# Altium schematic sheet rf_modulator_source_top.SchDoc: SPE Router
size 420 x 297 mm; Author: P. Daniel; CompanyName: WUT ISE; DrawnBy: P. Daniel; Organization: WUT ISE; Address1: WUT ISE; Address2: Nowowiejska 15/19 00-665 Warsaw; Address3: piotrmaciejdaniel@gmail.com; Revision: 1; SheetNumber: 1; SheetTotal: 2; ModifiedBy: -; CreateDate: 02-03.2023; CheckedDate: -; Title2: top schematic; DivGrp: WUT ISE; Designer: Piotr Daniel
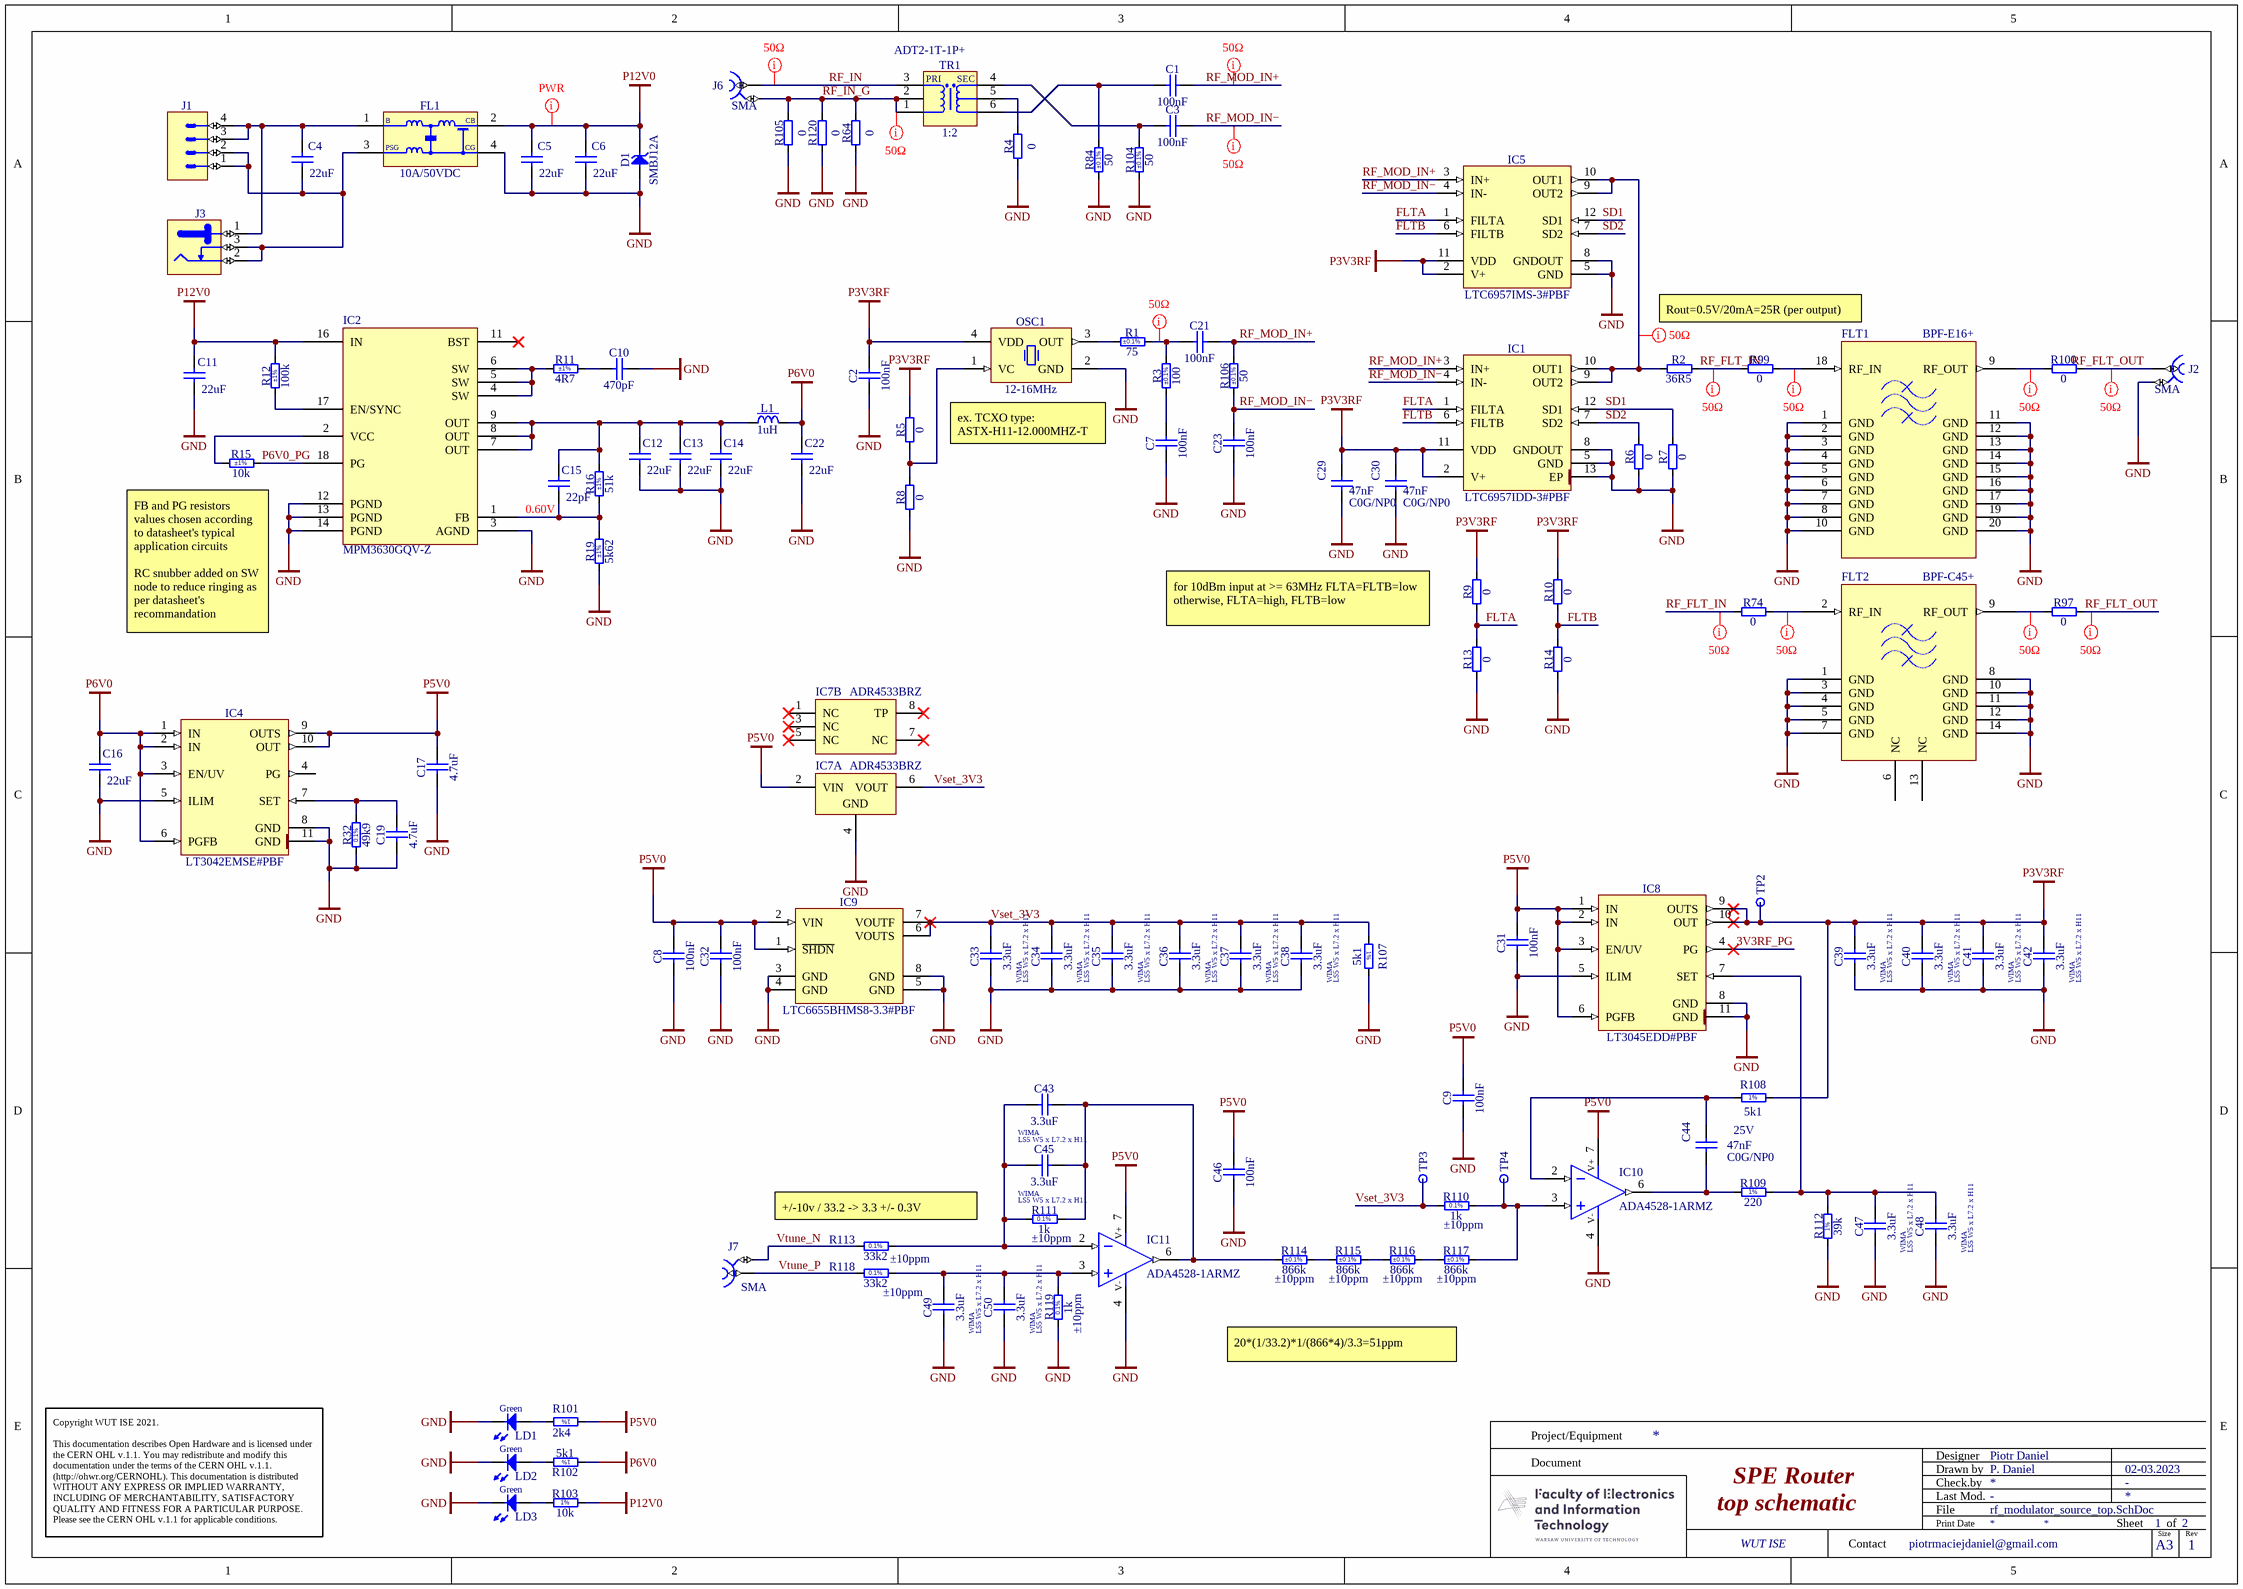
[diagram p0: rf_modulator_source_top.SchDoc]

## Parts
C1  100nF  [CAPC1608X87N]
C2  100nF  [CAPC1608X87N]
C3  100nF  [CAPC1608X87N]
C4  22uF  [CAPC3225X140N]
C5  22uF  [CAPC3225X140N]
C6  22uF  [CAPC3225X140N]
C7  100nF  [CAPC1608X87N]
C8  100nF  [CAPC1608X87N]
C9  100nF  [CAPC1608X87N]
C10  470pF  [CAPC1005X55N]
C11  22uF  [CAPC3225X140N]
C12  22uF  [CAPC3225X140N]
C13  22uF  [CAPC3225X140N]
C14  22uF  [CAPC3225X140N]
C15  22pF  [CAPC1005X55N]
C16  22uF  [CAPC3225X140N]
C17  4.7uF  [CAPC3216X180N]
C19  4.7uF  [CAPC3216X180N]
C21  100nF  [CAPC1608X87N]
C22  22uF  [CAPC3225X140N]
C23  100nF  [CAPC1608X87N]
C29  47nF  TC: C0G/NP0  [CAPC2012X135N]
C30  47nF  TC: C0G/NP0  [CAPC2012X135N]
C31  100nF  [CAPC1608X87N]
C32  100nF  [CAPC1608X87N]
C33  3.3uF  Manufacturer: WIMA  Case: LS5 W5 x L7.2 x H11  [CAPR500-500X720X1000]
C34  3.3uF  Manufacturer: WIMA  Case: LS5 W5 x L7.2 x H11  [CAPR500-500X720X1000]
C35  3.3uF  Manufacturer: WIMA  Case: LS5 W5 x L7.2 x H11  [CAPR500-500X720X1000]
C36  3.3uF  Manufacturer: WIMA  Case: LS5 W5 x L7.2 x H11  [CAPR500-500X720X1000]
C37  3.3uF  Manufacturer: WIMA  Case: LS5 W5 x L7.2 x H11  [CAPR500-500X720X1000]
C38  3.3uF  Manufacturer: WIMA  Case: LS5 W5 x L7.2 x H11  [CAPR500-500X720X1000]
C39  3.3uF  Manufacturer: WIMA  Case: LS5 W5 x L7.2 x H11  [CAPR500-500X720X1000]
C40  3.3uF  Manufacturer: WIMA  Case: LS5 W5 x L7.2 x H11  [CAPR500-500X720X1000]
C41  3.3uF  Manufacturer: WIMA  Case: LS5 W5 x L7.2 x H11  [CAPR500-500X720X1000]
C42  3.3uF  Manufacturer: WIMA  Case: LS5 W5 x L7.2 x H11  [CAPR500-500X720X1000]
C43  3.3uF  Manufacturer: WIMA  Case: LS5 W5 x L7.2 x H11  [CAPR500-500X720X1000]
C44  47nF  Voltage: 25V  TC: C0G/NP0  [CAPC2012X135N]
C45  3.3uF  Manufacturer: WIMA  Case: LS5 W5 x L7.2 x H11  [CAPR500-500X720X1000]
C46  100nF  [CAPC1608X87N]
C47  3.3uF  Manufacturer: WIMA  Case: LS5 W5 x L7.2 x H11  [CAPR500-500X720X1000]
C48  3.3uF  Manufacturer: WIMA  Case: LS5 W5 x L7.2 x H11  [CAPR500-500X720X1000]
C49  3.3uF  Manufacturer: WIMA  Case: LS5 W5 x L7.2 x H11  [CAPR500-500X720X1000]
C50  3.3uF  Manufacturer: WIMA  Case: LS5 W5 x L7.2 x H11  [CAPR500-500X720X1000]
D1  SMBJ12A  [DIOM5336X265N]
FL1  10A/50VDC  [FIL_MURATA_BNX02]
FLT1  BPF-E16+  [HR1176]
FLT2  BPF-C45+  [HU1186]
IC1  LTC6957IDD-3#PBF  [SON45P300X300X80-13N-R175X248]
IC2  MPM3630GQV-Z  [MPM3610A]
IC4  LT3042EMSE#PBF  [SOP50P490X110-11N-R168X198]
IC5  LTC6957IMS-3#PBF  [SOP65P490X110-12N]
IC7  ADR4533BRZ  [ADI-R-8_L]  (parts A,B of 2)
IC8  LT3045EDD#PBF  [SON50P300X300X80-11N-R175X248]
IC9  LTC6655BHMS8-3.3#PBF  [SOP65P490X110-8N]
IC10  ADA4528-1ARMZ  [SOP65P490X110-8N]
IC11  ADA4528-1ARMZ  [SOP65P490X110-8N]
J1  Mini-Fit Jr.™  [MOLEX_39-30-0040]  (value not drawn)
J2  SMA  [MOLEX_73251-2121]
J3  Jack  [SWITCHCRAFT_712RA]  (value not drawn)
J6  SMA  [MOLEX_73251-2121]
J7  SMA  [MOLEX_73251-2121]
L1  1uH  [INDM3225X210N]
LD1  Green  [LED_KINGBRIGHT_KPH-1608CGCK]
LD2  Green  [LED_KINGBRIGHT_KPH-1608CGCK]
LD3  Green  [LED_KINGBRIGHT_KPH-1608CGCK]
OSC1  12-16MHz  [OSC_TAITIEN_3.2X2.5X1.0]
R1  75  Tolerance: ±0.1%  [RESC1608X55N]
R2  36R5  [RESC1005X40N]
R3  100  Tolerance: ±0.1%  [RESC1608X64N]
R4  0  [RESC1608X55N]
R5  0  [RESC1608X55N]
R6  0  [RESC1608X55N]
R7  0  [RESC1608X55N]
R8  0  [RESC1608X55N]
R9  0  [RESC1608X55N]
R10  0  [RESC1608X55N]
R11  4R7  Tolerance: ±1%  [RESC1005X40N]
R12  100k  Tolerance: ±1%  [RESC1005X40N]
R13  0  [RESC1608X55N]
R14  0  [RESC1608X55N]
R15  10k  Tolerance: ±1%  [RESC1005X40N]
R16  51k  Tolerance: ±1%  [RESC1005X40N]
R19  5k62  Tolerance: ±1%  [RESC1005X40N]
R32  49k9  [RESC1608X55N]
R64  0  [RESC1608X55N]
R74  0  [RESC1005X40N]
R84  50  Tolerance: ±0.1%  [RES_VISHAY_FC0603]
R97  0  [RESC1005X40N]
R99  0  [RESC1005X40N]
R100  0  [RESC1005X40N]
R101  2k4  [RESC1005X40N]
R102  5k1  [RESC1005X40N]
R103  10k  [RESC1005X40N]
R104  50  Tolerance: ±0.1%  [RES_VISHAY_FC0603]
R105  0  [RESC1608X55N]
R106  50  Tolerance: ±0.1%  [RES_VISHAY_FC0603]
R107  5k1  [RESC1005X40N]
R108  5k1  [RESC1005X40N]
R109  220  [RESC1005X40N]
R110  1k  TC: ±10ppm  [RESC1608X55N]
R111  1k  TC: ±10ppm  [RESC1608X55N]
R112  39k  [RESC1608X55N]
R113  33k2  TC: ±10ppm  [RESC1608X55N]
R114  866k  Tolerance: ±0.1%  TC: ±10ppm  [RESC2012X60N]
R115  866k  Tolerance: ±0.1%  TC: ±10ppm  [RESC2012X60N]
R116  866k  Tolerance: ±0.1%  TC: ±10ppm  [RESC2012X60N]
R117  866k  Tolerance: ±0.1%  TC: ±10ppm  [RESC2012X60N]
R118  33k2  TC: ±10ppm  [RESC1608X55N]
R119  1k  TC: ±10ppm  [RESC1608X55N]
R120  0  [RESC1608X55N]
TP2  Test Point  [TPS127]  (value not drawn)
TP3  Test Point  [TPS127]  (value not drawn)
TP4  Test Point  [TPS127]  (value not drawn)
TR1  1:2  Manufacturer Part Number: ADT2-1T-1P+  [XFMR_MINI-CIRCUITS_CD542]

## Nets
GND: C2.1 C5.1 C6.1 C7.1 C8.1 C9.1 C10.2 C11.1 C12.1 C13.1 C14.1 C16.1 C17.1 C19.1 C22.1 C23.1 C29.1 C30.1 C31.1 C32.1 C33.1 C34.1 C35.1 C36.1 C37.1 C38.1 C39.1 C40.1 C41.1 C42.1 C46.1 C47.1 C48.1 C49.1 C50.1 D1.2(A) FL1.4(CG) FLT1.1(GND) FLT1.2(GND) FLT1.3(GND) FLT1.4(GND) FLT1.5(GND) FLT1.6(GND) FLT1.7(GND) FLT1.8(GND) FLT1.10(GND) FLT1.11(GND) FLT1.12(GND) FLT1.13(GND) FLT1.14(GND) FLT1.15(GND) FLT1.16(GND) FLT1.17(GND) FLT1.19(GND) FLT1.20(GND) FLT2.1(GND) FLT2.3(GND) FLT2.4(GND) FLT2.5(GND) FLT2.7(GND) FLT2.8(GND) FLT2.10(GND) FLT2.11(GND) FLT2.12(GND) FLT2.14(GND) IC1.5(GND) IC1.8(GNDOUT) IC1.13(EP) IC2.3(AGND) IC2.12(PGND) IC2.13(PGND) IC2.14(PGND) IC4.5(ILIM) IC4.8(GND) IC4.11(GND) IC5.5(GND) IC5.8(GNDOUT) IC7.4(GND) IC8.5(ILIM) IC8.8(GND) IC8.11(GND) IC9.3(GND) IC9.4(GND) IC9.5(GND) IC9.8(GND) IC10.4(V-) IC11.4(V-) J2.2 LD1.1(C) LD2.1(C) LD3.1(C) OSC1.2(GND) R4.1 R6.1 R7.1 R8.1 R13.1 R14.1 R19.1 R32.1 R64.1 R84.1 R104.1 R105.1 R107.2 R112.1 R119.1 R120.1
P3V3RF: C2.2 C29.2 C30.2 C39.2 C40.2 C41.2 C42.2 IC1.2(V+) IC1.11(VDD) IC5.2(V+) IC5.11(VDD) IC8.9(OUTS) IC8.10(OUT) OSC1.4(VDD) R5.2 R9.2 R10.2 R108.1 TP2.1
P5V0: C8.2 C9.2 C17.2 C31.2 C32.2 C46.2 IC4.9(OUTS) IC4.10(OUT) IC7.2(VIN) IC8.1(IN) IC8.2(IN) IC8.3(EN/UV) IC8.6(PGFB) IC9.1(~{SHDN}) IC9.2(VIN) IC10.7(V+) IC11.7(V+) R101.1
P6V0: C16.2 C22.2 IC4.1(IN) IC4.2(IN) IC4.3(EN/UV) IC4.6(PGFB) L1.2 R102.1
P12V0: C5.2 C6.2 C11.2 D1.1(C) FL1.2(CB) IC2.16(IN) R12.2 R103.2
3V3RF_PG: IC8.4(PG)
FLTA: IC1.1(FILTA) IC5.1(FILTA) R9.1 R13.2
FLTB: IC1.6(FILTB) IC5.6(FILTB) R10.1 R14.2
P6V0_PG: IC2.18(PG) R15.2
RF_FLT_IN: R2.2 R74.1 R99.1
RF_FLT_OUT: J2.1 R97.2 R100.2
RF_IN: J6.1 TR1.3(PDOT)
RF_IN_G: J6.2 R64.2 R105.2 R120.2 TR1.1(P) TR1.2(NC)
RF_MOD_IN+: C1.2 C21.2 IC1.3(IN+) IC5.3(IN+) R106.2
RF_MOD_IN−: C3.2 C23.2 IC1.4(IN-) IC5.4(IN-) R106.1
SD1: IC1.12(SD1) IC5.12(SD1) R7.2
SD2: IC1.7(SD2) IC5.7(SD2) R6.2
Vset_3V3: C33.2 C34.2 C35.2 C36.2 C37.2 C38.2 IC7.6(VOUT) IC9.6(VOUTS) IC9.7(VOUTF) R107.1 R110.1 TP3.1
Vtune_N: J7.2 R113.1
Vtune_P: J7.1 R118.1
NetC1_1: C1.1 R84.2 TR1.6(SDOT)
NetC3_1: C3.1 R104.2 TR1.4(S)
NetC4_1: C4.1 FL1.3(PSG) J1.1 J1.2 J3.2 J3.3
NetC4_2: C4.2 FL1.1(B) J1.3 J1.4 J3.1
NetC7_2: C7.2 R3.1
NetC10_1: C10.1 R11.2
NetC12_2: C12.2 C13.2 C14.2 C15.2 IC2.7(OUT) IC2.8(OUT) IC2.9(OUT) L1.1 R16.2
NetC15_1: C15.1 IC2.1(FB) R16.1 R19.2
NetC19_2: C19.2 IC4.7(SET) R32.2
NetC21_1: C21.1 R1.2 R3.2
NetC43_1: C43.1 C45.1 IC11.2(IN-) R111.1 R113.2
NetC43_2: C43.2 C45.2 IC11.6(OUT) R111.2 R114.1
NetC44_1: C44.1 IC10.6(OUT) R109.1
NetC44_2: C44.2 IC10.2(IN-) R108.2
NetC47_2: C47.2 C48.2 IC8.7(SET) R109.2 R112.2
NetC49_2: C49.2 C50.2 IC11.3(IN+) R118.2 R119.2
NetFLT1_9: FLT1.9(RF_OUT) R100.1
NetFLT1_18: FLT1.18(RF_IN) R99.2
NetFLT2_2: FLT2.2(RF_IN) R74.2
NetFLT2_9: FLT2.9(RF_OUT) R97.1
NetIC1_9: IC1.9(OUT2) IC1.10(OUT1) IC5.9(OUT2) IC5.10(OUT1) R2.1
NetIC2_2: IC2.2(VCC) R15.1
NetIC2_4: IC2.4(SW) IC2.5(SW) IC2.6(SW) R11.1
NetIC2_17: IC2.17(EN/SYNC) R12.1
NetIC10_3: IC10.3(IN+) R110.2 R117.2 TP4.1
NetLD1_2: LD1.2(A) R101.2
NetLD2_2: LD2.2(A) R102.2
NetLD3_2: LD3.2(A) R103.1
NetOSC1_1: OSC1.1(VC) R5.1 R8.2
NetOSC1_3: OSC1.3(OUT) R1.1
NetR4_2: R4.2 TR1.5(SCT)
NetR114_2: R114.2 R115.1
NetR115_2: R115.2 R116.1
NetR116_2: R116.2 R117.1

Not connected (* = marked no-connect by the designer): FLT2 6(NC) 13(NC); IC2 11(BST)*; IC4 4(PG); IC7 1(NC)* 3(NC)* 5(NC)* 7(NC)* 8(TP)*

## Layout directives
net class 50Ohm: NetC21_1, NetFLT1_9, NetFLT1_18, NetFLT2_2, NetFLT2_9, NetIC1_9, RF_FLT_IN, RF_FLT_OUT, RF_IN, RF_IN_G, RF_MOD_IN+, RF_MOD_IN−
net class PWR: P12V0

## Notes on the sheet
- Rout=0.5V/20mA=25R (per output)
- ex. TCXO type:
  ASTX-H11-12.000MHZ-T
- (near C15) 0.60V
- (near R15) FB and PG resistors values chosen according to datasheet's typical application circuits
  RC snubber added on SW node to reduce ringing as per datasheet's recommandation
- for 10dBm input at >= 63MHz FLTA=FLTB=low
  otherwise, FLTA=high, FLTB=low
- (near R113) +/-10v / 33.2 -> 3.3 +/- 0.3V
- 20*(1/33.2)*1/(866*4)/3.3=51ppm
- Project/Equipment
- Document
- Designer
- Drawn by
- Check.by
- Copyright WUT ISE 2021.
  This documentation describes Open Hardware and is licensed under the CERN OHL v.1.1. You may redistribute and modify this documentation under the terms of the CERN OHL v.1.1. (http://ohwr.org/CERNOHL). This documentation is distributed WITHOUT ANY EXPRESS OR IMPLIED WARRANTY, INCLUDING OF MERCHANTABILITY, SATISFACTORY QUALITY AND FITNESS FOR A PARTICULAR PURPOSE. Please see the CERN OHL v.1.1 for applicable conditions.
- Contact
- File
- Last Mod.
- Print Date
- Sheet
- Size
- A3
- of
- Rev
- (in symbol R0402_2K4_1%_0.0625W_100PPM) 1%
- (in symbol R0402_5K1_1%_0.0625W_100PPM) 1%
- (in symbol R0402_10K_1%_0.0625W_100PPM) 1%
- (in symbol R0402_220R_1%_0.0625W_100PPM) 1%
- (in symbol R0603_1K_0.1%_0.063W_10PPM) 0.1%
- (in symbol R0603_33K2_0.1%_0.063W_10PPM) 0.1%
- (in symbol R0603_39K_1%_0.1W_100PPM) 1%
- (in symbol R0603_49K9_0.1%_0.063W_10PPM) 0.1%
- (in symbol XFMR_MINI-CIRCUITS_ADT2-1T-1P+) PRI; SEC

## Library data of the parts
C1-C3 C7-C9 C21 C23 C31 C32 C46 = CC0603_100NF_50V_10%_X7R: Non-polarised capacitor; Part Description: SMD Multilayer Chip Ceramic Capacitor; Manufacturer: GENERIC; Manufacturer1 Part Number: 223858615649; Voltage: 50V; TC: X7R; Tolerance: ±10%; Part Number: CC0603_100NF_50V_10%_X7R; Component Kind: Standard; Component Type: Standard; Pin Count: 2; Value: 100nF; Status: Preferred; Manufacturer Part Number: CC0603_100NF_50V_10%_X7R; Case: 0603; Mounted: Yes; Socket: No; SMD: Yes; Sense: No; Manufacturer1 Example: PHYCOMP; Manufacturer1 ComponentHeight: 0.87mm; HelpURL: \\cern.ch\dfs\Applications\Altium\Datasheets\CC0603_X7R_PHYCOMP.pdf; Author: CERN DEM JLC; CreateDate: 03/12/2007; LatestRevisionDate: 03/12/2007
C4-C6 C11-C14 C16 C22 = CC1210_22UF_25V_10%_X7R: Non-polarised capacitor; Part Description: SMD Multilayer Chip Ceramic Capacitor; Manufacturer: GENERIC; Manufacturer1 Part Number: C1210C226K3RAC; Voltage: 25V; TC: X7R; Tolerance: ±10%; Part Number: CC1210_22UF_25V_10%_X7R; Component Kind: Standard; Component Type: Standard; Pin Count: 2; Value: 22uF; Status: None; Manufacturer Part Number: CC1210_22UF_25V_10%_X7R; Case: 1210; Mounted: Yes; Socket: No; SMD: Yes; Sense: No; Manufacturer1 Example: KEMET; Manufacturer1 ComponentHeight: 1.4mm; HelpURL: \\cern.ch\dfs\Applications\Altium\Datasheets\CC1210_X7R_KEMET.pdf; Author: CERN DEM BC; CreateDate: 20.08.2020; LatestRevisionDate: 20.08.2020
C10 = CC0402_470PF_50V_10%_X7R: Non-polarised capacitor; Part Description: SMD Multilayer Chip Ceramic Capacitor; Manufacturer: GENERIC; Manufacturer1 Part Number: 223858715618; Voltage: 50V; TC: X7R; Tolerance: ±10%; Part Number: CC0402_470PF_50V_10%_X7R; Component Kind: Standard; Component Type: Standard; Pin Count: 2; Value: 470pF; Status: Not Recommended; Manufacturer Part Number: CC0402_470PF_50V_10%_X7R; Case: 0402; Mounted: Yes; Socket: No; SMD: Yes; Sense: No; Manufacturer1 Example: PHYCOMP; Manufacturer1 ComponentHeight: 0.55mm; HelpURL: \\cern.ch\dfs\Applications\Altium\Datasheets\CC0402_NP0_PHYCOMP.pdf; Author: CERN DEM JLC; CreateDate: 03.12.2007; LatestRevisionDate: 03.12.2007
C15 = CC0402_22PF_50V_5%_C0G: Non-polarised capacitor; Part Description: SMD Multilayer Chip Ceramic Capacitor; Manufacturer: GENERIC; Manufacturer1 Part Number: C0402C220J5GACTU; Voltage: 50V; TC: C0G/NP0; Tolerance: ±5%; Part Number: CC0402_22PF_50V_5%_C0G; Component Kind: Standard; Component Type: Standard; Pin Count: 2; Value: 22pF; Status: Preferred; Manufacturer Part Number: CC0402_22PF_50V_5%_C0G; Case: 0402; Mounted: Yes; Socket: No; SMD: Yes; Sense: No; Manufacturer1 Example: KEMET; Manufacturer1 ComponentHeight: 0.55mm; HelpURL: \\cern.ch\dfs\Applications\Altium\Datasheets\CC0402_C0G_KEMET_(Commercial Grade).pdf; Author: CERN DEM JLC; CreateDate: 03.12.2007; LatestRevisionDate: 03.12.2007
C17 C19 = CC1206_4.7UF_16V_10%_X5R: Non-polarised capacitor; Part Description: SMD Multilayer Chip Ceramic Capacitor; Manufacturer: GENERIC; Manufacturer1 Part Number: C1206C475K4PAC; Voltage: 16V; TC: X5R; Tolerance: ±10%; Part Number: CC1206_4.7UF_16V_10%_X5R; Component Kind: Standard; Component Type: Standard; Pin Count: 2; Value: 4.7uF; Status: Preferred; Manufacturer Part Number: CC1206_4.7UF_16V_10%_X5R; Case: 1206; Mounted: Yes; Socket: No; SMD: Yes; Sense: No; Manufacturer1 Example: KEMET; Manufacturer1 ComponentHeight: 1.8mm; HelpURL: \\cern.ch\dfs\Applications\Altium\Datasheets\CC1206_X5R_KEMET.pdf; Author: CERN DEM JLC; CreateDate: 03/12/2007; LatestRevisionDate: 03/12/2007
C29 C30 = CC0805_47NF_25V_5%_C0G: Non-polarised capacitor; Part Description: SMD Multilayer Chip Ceramic Capacitor; Manufacturer: GENERIC; Manufacturer1 Part Number: C0805C473J3GACTU; Voltage: 25V; Tolerance: ±5%; Part Number: CC0805_47NF_25V_5%_C0G; Component Kind: Standard; Component Type: Standard; Pin Count: 2; Value: 47nF; Status: None; Manufacturer Part Number: CC0805_47NF_25V_5%_C0G; Case: 0805; Mounted: Yes; Socket: No; SMD: Yes; Sense: No; Manufacturer1 Example: KEMET; Manufacturer1 ComponentHeight: 1.4mm; HelpURL: \\cern.ch\dfs\Applications\Altium\Datasheets\CC0805_C0G_KEMET_(Commercial Grade).pdf; Author: CERN DEM JLC; CreateDate: 18/01/2011; LatestRevisionDate: 18/01/2011
C33-C43 C45 C47-C50 = CPER_3.3UF_63V_5%_WIMA_MKS2: Non-polarised capacitor; Part Description: Metallized Polypropylene Film Capacitor (MKP2); Manufacturer Part Number: MKS2C043301K00JSSD; Voltage: 63V; Tolerance: ±5%; Part Number: CPER_3.3UF_63V_5%_WIMA_MKS2; Component Kind: Standard; Component Type: Standard; Pin Count: 2; Value: 3.3uF; Status: None; Mounted: Yes; Socket: No; SMD: No; Sense: No; ComponentHeight: 10mm; HelpURL: \\cern.ch\dfs\Applications\Altium\Datasheets\CPPR_WIMA_MKP2.pdf; Author: GK; CreateDate: 04.10.2018; LatestRevisionDate: 04.10.2018
C44 = CC0805_47NF_25V_5%_C0G: Non-polarised capacitor; Part Description: SMD Multilayer Chip Ceramic Capacitor; Manufacturer: GENERIC; Manufacturer1 Part Number: C0805C473J3GACTU; Tolerance: ±5%; Part Number: CC0805_47NF_25V_5%_C0G; Component Kind: Standard; Component Type: Standard; Pin Count: 2; Value: 47nF; Status: None; Manufacturer Part Number: CC0805_47NF_25V_5%_C0G; Case: 0805; Mounted: Yes; Socket: No; SMD: Yes; Sense: No; Manufacturer1 Example: KEMET; Manufacturer1 ComponentHeight: 1.4mm; HelpURL: \\cern.ch\dfs\Applications\Altium\Datasheets\CC0805_C0G_KEMET_(Commercial Grade).pdf; Author: CERN DEM JLC; CreateDate: 18/01/2011; LatestRevisionDate: 18/01/2011
D1 = SMBJ12A: Zener Diode; Part Description: Uni-Directional Transient Voltage Suppressor Diode; Manufacturer: FAIRCHILD SEMICONDUCTOR; Voltage: 12V; Power: 600W; PressFit: No; Bonding: No; Part Number: SMBJ12A; Component Kind: Standard; Component Type: Standard; Device: SMBJ12A; PackageDescription: DO-214-AA/SMB Diode, Molded Body; 5.34mm L X 3.625mm W X 2.65mm H, IPC Medium Density; Manufacturer Part Number: SMBJ12A; Pin Count: 2; Case: DO-214AA; Mounted: Yes; Socket: No; SMD: Yes; Sense: No; ComponentHeight: 2.65mm; HelpURL: \\cern.ch\dfs\Applications\Altium\Datasheets\SMBJ.pdf; Author: CERN DEM JLC; CreateDate: 10.04.2013; LatestRevisionDate: 10.04.2013
FL1 = FIL_MURATA_BNX022-01L: Block Type EMIFIL (LC Combined); Part Description: Block Type EMIFIL (LC Combined) SMD Type, BNX02* Series; Manufacturer: MURATA; Resistance: 0.5R; Part Number: FIL_MURATA_BNX022-01L; Component Kind: Standard; Component Type: Standard; Pin Count: 2; Value: 10A/50VDC; Status: None; Manufacturer Part Number: BNX022-01L; Mounted: Yes; Socket: No; SMD: Yes; Sense: No; ComponentHeight: 3.3mm; HelpURL: \\cern.ch\dfs\Applications\Altium\Datasheets\FIL_MURATA_BNX022-01L.pdf; Author: CERN DEM JLC; CreateDate: 10.10.2012; LatestRevisionDate: 10.10.2012
FLT1 = BPF-E16+: Band Pass Filter, 16MHz; Manufacturer: Mini-Circuits; Average Input Power: 500mW; Input Impedance: 50R; Insertion Loss-Max: 3dB; VSWR: 1.9; Supplier 1: Digikey; Manufacturer Part Number: BPF-E16+; RoHS: Yes; Stock 1: 41; Pricing 1: 1=36,35, 10=33,312, 50=31,8 (USD); Mounting Technology: Surface Mount; Terminal Finish: Gold; Min Operating Temperature: -40°C; Max Operating Temperature: 85°C; JESD-609 Code: e4; Center or Cutoff Frequency (fo/fc): 16MHz; Filter Type: BAND PASS FILTER; Output Impedance: 50R; Length: 30.48mm; Width: 30.48mm; Height: 9.4mm; RoHS Compliant: Yes; Reach SVHC Compliant: Yes; ComponentLink1URL: https://datasheet.ciiva.com:443/pdfs/VipMasterIC/IC/MINI/MINI-S-A0002947472/MINI-S-A0002947472-1.pdf?src-supplier=IHS+Markit; ComponentLink1Description: https://datasheet.ciiva.com:443/pdfs/VipMasterIC/IC/MINI/MINI-S-A0002947472/MINI-S-A0002947472-1.pdf?src-supplier=IHS+Markit; Supplier Part Number 1: 3157-BPF-E16+CT-ND
FLT2 = BPF-C45+: Band Pass Filter, 45MHz, 14 Pin(s); Manufacturer: Mini-Circuits; Supplier 1: Digikey; Manufacturer Part Number: BPF-C45+; RoHS: Yes; Stock 1: 219; Pricing 1: 1=48,49, 10=45,456, 25=42,4204, 50=40,908, 100=39,3841 (USD); Supplier Part Number 1: 3157-BPF-C45+CT-ND
IC1 = LTC6957IDD-3#PBF: Low Phase Noise, Dual Output Buffer/Driver/Logic Converter, CMOS Logic, In-Phase Outputs; Manufacturer: LINEAR TECHNOLOGY; PressFit: No; Bonding: No; Part Number: LTC6957IDD-3#PBF; Component Kind: Standard; Component Type: Standard; Device: LTC6957IDD-3#PBF; PackageDescription: SON, 0.45mm Pitch; 12 Pin, 3.00mm W X 3.00mm L X 0.80mm H Body (w/Thermal tab 1.75 x 2.48mm), IPC Medium Density; Part Description: Low Phase Noise, Dual Output Buffer/Driver/Logic Converter, CMOS Logic, In-Phase Outputs; Manufacturer Part Number: LTC6957IDD-3#PBF; Pin Count: 13; Case: SON12; Mounted: Yes; Socket: No; SMD: Yes; Sense: No; ComponentHeight: 0.8mm; Author: CERN DEM JMW; HelpURL: \\cern.ch\dfs\Applications\Altium\Datasheets\LTC6957IDD-3#PBF.pdf; CreateDate: 08/08/2016; LatestRevisionDate: 07/12/2016
IC2 = MPM3630GQV-Z: 18V/3A DC/DC Module Synchronous Step-Down Regulator with Integrated Inductor; Manufacturer: Monolithic Power Systems; Supplier 1: Farnell; Manufacturer Part Number: MPM3630GQV-Z; RoHS: Yes; Category: Board Mount Modules; Stock 1: 4233; Case/Package: QFN; Pins: 18; Series: *; RoHS Compliant: Yes; ComponentLink1URL: http://www.monolithicpower.com/pub/media/document/MPM3630_r1.0.pdf?src-supplier=Digikey; ComponentLink1Description: http://www.monolithicpower.com/pub/media/document/MPM3630_r1.0.pdf?src-supplier=Digikey; ComponentLink2URL: https://www.monolithicpower.com/pub/media/document/MPM3630_r1.0.pdf?src-supplier=Digikey; ComponentLink2Description: https://www.monolithicpower.com/pub/media/document/MPM3630_r1.0.pdf?src-supplier=Digikey; ComponentLink3URL: https://datasheet.octopart.com/MPM3630GQV-Z-Monolithic-Power-Systems-datasheet-140259359.pdf?src-supplier=Newark; ComponentLink3Description: https://datasheet.octopart.com/MPM3630GQV-Z-Monolithic-Power-Systems-datasheet-140259359.pdf?src-supplier=Newark; ComponentLink4URL: https://datasheet.octopart.com/MPM3630GQV-Z-Monolithic-Power-Systems-datasheet-81324618.pdf?src-supplier=Future+Electronics; ComponentLink4Description: https://datasheet.octopart.com/MPM3630GQV-Z-Monolithic-Power-Systems-datasheet-81324618.pdf?src-supplier=Future+Electronics; ComponentLink5URL: https://www.monolithicpower.com/DesktopModules/DocumentManage/API/Document/GetDocument?id=4863&src-supplier=Digikey; ComponentLink5Description: https://www.monolithicpower.com/DesktopModules/DocumentManage/API/Document/GetDocument?id=4863&src-supplier=Digikey; ComponentLink6URL: https://datasheet.octopart.com/MPM3630GQV-Z-Monolithic-Power-Systems-datasheet-155982336.pdf?src-supplier=Monolithic+Power+Systems; ComponentLink6Description: https://datasheet.octopart.com/MPM3630GQV-Z-Monolithic-Power-Systems-datasheet-155982336.pdf?src-supplier=Monolithic+Power+Systems; Supplier Part Number 1: 3358182
IC4 = LT3042EMSE#PBF: 20V, 200mA, Ultralow Noise, Ultrahigh PSRR RF Linear Regulator; Manufacturer: LINEAR TECHNOLOGY; PressFit: No; Bonding: No; Part Number: LT3042EMSE#PBF; Component Kind: Standard; Component Type: Standard; Device: LT3042EMSE#PBF; PackageDescription: SOP, 0.50mm, Pitch; 10 pin, 3.00mm W X 3.00mm L X 1.10mm H body (w/thermal tab  1.68 X 1.98 mm), IPC Medium Density; Part Description: 20V, 200mA, Ultralow Noise, Ultrahigh PSRR RF Linear Regulator; Manufacturer Part Number: LT3042EMSE#PBF; Pin Count: 11; Case: MSOP10; Mounted: Yes; Socket: No; SMD: Yes; Sense: No; ComponentHeight: 1.1mm; HelpURL: \\cern.ch\dfs\Applications\Altium\Datasheets\LT3042EMSE#PBF.pdf; Author: CERN DEM MR; CreateDate: 09/06/2016; LatestRevisionDate: 09/06/2016
IC5 = LTC6957IMS-3#PBF: Low Phase Noise, Dual Output Buffer/Driver/Logic Converter; Part Description: Low Phase Noise, Dual Output Buffer/Driver/Logic Converter, CMOS Logic, In-Phase Outputs; Manufacturer: LINEAR TECHNOLOGY; PressFit: No; Bonding: No; Part Number: LTC6957IMS-3#PBF; Component Kind: Standard; Component Type: Standard; Device: LTC6957IMS-3#PBF; PackageDescription: SOP, 12-Leads, Body 4.14x3.1mm (max), Pitch 0.65mm, IPC Medium Density; Manufacturer Part Number: LTC6957IMS-3#PBF; Pin Count: 12; Case: MSOP12; Mounted: Yes; Socket: No; SMD: Yes; Sense: No; ComponentHeight: 1.1mm; Author: CERN DEM JMW; HelpURL: \\cern.ch\dfs\Applications\Altium\Datasheets\LTC6957IMS-3#PBF.pdf; CreateDate: 08.08.2016; LatestRevisionDate: 07.12.2016
IC7 = CMP-0784-00188-1: Ultralow Noise, High Accuracy Voltage Reference, 3.3 V Output, 3 to 15 V Supply, Industrial, 8-pin SOIC (R-8), Tube; Manufacturer: Analog Devices; Min V Supply (V): 3; Ref Out TC (ppm/C): 2; Max V Supply (V): 15; Vout: 3.3V; ComponentLink1URL: http://www.analog.com/en/index.html; ComponentLink3Description: Package Specification; Operating Temp Range: -40 to 125 degC; PartNumber: ADR4533BRZ; DatasheetVersion: Rev. 0; ComponentLink3URL: http://www.analog.com/static/imported-files/packages/PKG_PDF/SOIC_Narrow%20(R)/R_8.pdf; Packing: Tube; ComponentLink2URL: http://www.analog.com/static/imported-files/data_sheets/ADR4520_4525_4530_4533_4540_4550.pdf; Code_JEDEC: MS-012-AA; PackageVersion: 060506-A, 06/2006; ComponentLink4Description: URL Link1; ComponentLink1Description: Manufacturer URL; PackageReference: R-8; ComponentLink4URL: Product URL:http://www.analog.com/en/special-linear-functions/voltage-references/adr4533/products/product.html; PackageDescription: 8-Pin Standard Small Outline Package, Body 4.9 x 3.9 mm, Pitch 1.27 mm; ComponentLink2Description: Datasheet; Mounting Technology: Surface Mount
IC8 = LT3045EDD#PBF: 20V, 500mA, Ultralow Noise, Ultrahigh PSRR Linear Regulator; Manufacturer: LINEAR TECHNOLOGY; PressFit: No; Bonding: No; Part Number: LT3045EDD#PBF; Component Kind: Standard; Component Type: Standard; Device: LT3045EDD#PBF; PackageDescription: SON, 0.50mm Pitch; 10 Pin, 3.00mm W X 3.00mm L X 0.80mm H body (w/Thermal Tab 1.75 X 2.48 mm), IPC Medium Density; Part Description: 20V, 500mA, Ultralow Noise, Ultrahigh PSRR Linear Regulator; Manufacturer Part Number: LT3045EDD#PBF; Pin Count: 11; Case: SON10; Mounted: Yes; Socket: No; SMD: Yes; Sense: No; ComponentHeight: 0.8mm; HelpURL: \\cern.ch\dfs\Applications\Altium\Datasheets\LT3045EDD#PBF.pdf; Author: CERN DEM JLC; CreateDate: 07.12.2016; LatestRevisionDate: 07.12.2016
IC9 = LTC6655BHMS8-3.3#PBF: 0.25ppm Noise, Low Drift Precision Buffered Voltage Reference; Part Description: 3V3, 0.25ppm Noise, Low Drift Precision Buffered Voltage Reference; Manufacturer: LINEAR TECHNOLOGY; PressFit: No; Bonding: No; Part Number: LTC6655BHMS8-3.3#PBF; Component Kind: Standard; Component Type: Standard; Device: LTC6655BHMS8-3.3#PBF; PackageDescription: SOP, 8-Leads, Body 3.1x3.1mm (max), Pitch 0.65mm, IPC Medium Density; Manufacturer Part Number: LTC6655BHMS8-3.3#PBF; Pin Count: 8; Case: SSOP8; Mounted: Yes; Socket: No; SMD: Yes; Sense: No; ComponentHeight: 1.1mm; HelpURL: \\cern.ch\dfs\Applications\Altium\Datasheets\LTC6655BHMS8-3.3#PBF.pdf; Author: CERN DEM BC; CreateDate: 03/03/2016; LatestRevisionDate: 22/11/2016
IC10 IC11 = ADA4528-1ARMZ: Operational Amplifier; Part Description: Precision, Ultralow Noise, RRIO, Zero-Drift Operational Amplifier; Manufacturer: ANALOG DEVICES; PressFit: No; Bonding: No; Part Number: ADA4528-1ARMZ; Component Kind: Standard; Component Type: Standard; Device: ADA4528-1ARMZ; PackageDescription: SOP, 0.65mm Pitch; 8 Pin, 3.00mm W X 3.00mm L X 1.10mm H body, IPC Medium Density; Manufacturer Part Number: ADA4528-1ARMZ; Pin Count: 8; Case: MSOP8; Mounted: Yes; Socket: No; SMD: Yes; Sense: No; ComponentHeight: 1.1mm; Author: CERN DEM JLC; HelpURL: \\cern.ch\dfs\Applications\Altium\Datasheets\ADA4528-1ARMZ.pdf; CreateDate: 16.01.2012; LatestRevisionDate: 16.01.2012
J1 = MOLEX_39-30-0040: Connector 4 Male; Part Description: 4.20mm (.165") Pitch Mini-Fit Jr. Header, Dual Row, Right Angle with Snap-in Plastic Peg PCB Lock, 4 Circuits; Manufacturer: MOLEX; PressFit: No; Part Number: MOLEX_39-30-0040; Component Kind: Standard; Component Type: Standard; Pin Count: 4; Family: Mini-Fit Jr.™; Mounted: Yes; Socket: No; SMD: No; Sense: No; Status: None; Manufacturer Part Number: 39-30-0040; ComponentHeight: 11.4mm; HelpURL: \\cern.ch\dfs\Applications\Altium\Datasheets\MOLEX_39-30-0040.pdf; Author: CERN DEM JLC; CreateDate: 2018-10-02; LatestRevisionDate: 2018-10-02
J2 J6 J7 = MOLEX_73251-2121: Part Description: 50 Ohm, SMA Edge Mount PCB, With Jam Nut And Lock Washer; Manufacturer: MOLEX; PressFit: No; Part Number: MOLEX_73251-2121; Component Kind: Standard; Component Type: Standard; Pin Count: 5; Family: SMA; Mounted: Yes; Socket: No; SMD: No; Sense: No; Status: None; Manufacturer Part Number: 73251-2121; ComponentHeight: 5.75mm; HelpURL: \\cern.ch\dfs\Applications\Altium\Datasheets\MOLEX_73251-2121.pdf; Author: CERN DEM JLC; CreateDate: 26.10.2016; LatestRevisionDate: 27.03.2017
J3 = SWITCHCRAFT_712RA: 2.5 mm Center Pin, 5A, 48V, Right Angle, Through Hole, , DC Power Jack Connector; Part Description: 2.5 mm Center Pin, 5A, 48VDC, Right Angle, Through Hole, Locking Power Jack Connector (Threaded Bushings); Manufacturer Part Number: 712RA; PressFit: No; Part Number: SWITCHCRAFT_712RA; Component Kind: Standard; Component Type: Standard; Pin Count: 3; Family: Jack; Mounted: Yes; Socket: No; SMD: No; Sense: No; Status: None; Manufacturer: SWITCHCRAFT; ComponentHeight: 13.8mm; HelpURL: \\cern.ch\dfs\Applications\Altium\Datasheets\SWITCHCRAFT_712RA.pdf; Author: CERN DEM JLC; CreateDate: 2017-12-19; LatestRevisionDate: 2017-12-19
L1 = IND1210_1UH_10%_EPCOS_B82422A: Inductor With Core; Part Description: SMT Inductor SIMID Series; Manufacturer: EPCOS; Manufacturer Part Number: B82422A1102K100; Power: 380mA; Resistance: 0.34R; Tolerance: ±10%; Part Number: IND1210_1UH_10%_EPCOS_B82422A; Component Kind: Standard; Component Type: Standard; Pin Count: 2; Value: 1uH; Case: 1210; Mounted: Yes; Socket: No; SMD: Yes; Sense: No; ComponentHeight: 2.1mm; HelpURL: \\cern.ch\dfs\Applications\Altium\Datasheets\IND1210_EPCOS_B82422A.pdf; Author: CERN DEM JLC; CreateDate: 30.11.2011; LatestRevisionDate: 30.11.2011
LD1-LD3 = LED_KINGBRIGHT_KPH-1608CGCK: LED Green 1C 2A; Part Description: SMD Green LED, Case 1.6mmX0.8mm(0603), 0.65mm Thickness; PressFit: No; Bonding: No; Part Number: LED_KINGBRIGHT_KPH-1608CGCK; Component Kind: Standard; Component Type: Standard; Color: Green; PackageDescription: SMT Green LED, Case 0603, Body L 1.6 x W 0.8mm H 0.65mm; Manufacturer: KINGBRIGHT; Manufacturer Part Number: KPH-1608CGCK; Pin Count: 2; Mounted: Yes; Socket: No; SMD: Yes; Sense: No; ComponentHeight: 0.65mm; HelpURL: \\cern.ch\dfs\Applications\Altium\Datasheets\LED_KINGBRIGHT_KPH-1608CGCK.pdf; Author: CERN DEM JLC; CreateDate: 03/07/2017; LatestRevisionDate: 03/07/2017
OSC1 = OSC_25MHZ_TAITIEN_TXEAADSANF-25.000000: Oscillator 4 pins 1=VC 2=GND 3=OUT 4=VDD; Part Description: TCXO; PressFit: No; Bonding: No; Part Number: 12-16MHz; Component Kind: Standard; Component Type: Standard; PackageDescription: Oscillator, Corner Concave, 4 Pin, 3.2mm L X 2.5mm W X 1mm H; Value: 12-16Mhz; Pin Count: 4; Mounted: Yes; Socket: No; SMD: Yes; Sense: No; ComponentHeight: 1mm; HelpURL: \\cern.ch\dfs\Applications\Altium\Datasheets\OSC_TAITIEN_TX_TYPE.pdf; Author: CERN DEM HF; CreateDate: 15.03.2022; LatestRevisionDate: 15.03.2022
R1 = R0603_75R_0.1%_0.063W_25PPM: Resistor - 0.1%; Part Description: Thin Film Chip Resistor; Manufacturer: GENERIC; Manufacturer1 Part Number: CPF0603B75RE1; Power: 0.063W; TC: ±25ppm/°C; PressFit: No; Part Number: R0603_75R_0.1%_0.063W_25PPM; Component Kind: Standard; Component Type: Standard; Pin Count: 2; Value: 75; Status: Not Recommended; Manufacturer Part Number: R0603_75R_0.1%_0.063W_25PPM; Case: 0603; Mounted: Yes; Sense: No; Socket: No; SMD: Yes; Manufacturer1 Example: TE CONNECTIVITY; Manufacturer1 ComponentHeight: 0.55mm; HelpURL: \\cern.ch\dfs\Applications\Altium\Datasheets\R0603_TYCO_CPF.pdf; Author: CERN DEM JLC; CreateDate: 11.01.2017; LatestRevisionDate: 11.01.2017
R2 = R0402_36R_1%_0.0625W_100PPM: Resistor - 0.1%; Part Number: R0402_36R5_0.1%_0.0625W_50PPM; Part Description: General Purpose Thick Film Chip Resistor; Manufacturer: GENERIC; Manufacturer Part Number: R0402_36R_0.1%_0.0625W_50PPM; Manufacturer1 Part Number: 232270673609L; TC: ±100ppm/°C; PressFit: No; Component Kind: Standard; Component Type: Standard; Pin Count: 2; Value: 36R5; Status: Not Recommended; Power: 0.0625W; Tolerance: ±0.1%; Case: 0402; Mounted: Yes; Sense: No; Socket: No; SMD: Yes; Manufacturer1 Example: YAGEO PHYCOMP; Manufacturer1 ComponentHeight: 0.4mm; HelpURL: \\cern.ch\dfs\Applications\Altium\Datasheets\R0402_Phycomp_RC0402.pdf; Author: CERN DEM JLC; CreateDate: 03.12.2007; LatestRevisionDate: 17.10.2012
R3 = R0603_100R_0.1%_0.1W_25PPM: Resistor - 0.1%; Part Description: Thin Film Chip Resistor; Manufacturer: GENERIC; Manufacturer1 Part Number: ERA3AEB101V; Power: 0.1W; TC: ±25ppm/°C; PressFit: No; Part Number: R0603_100R_0.1%_0.1W_25PPM; Component Kind: Standard; Component Type: Standard; Pin Count: 2; Value: 100; Status: Not Recommended; Manufacturer Part Number: R0603_100R_0.1%_0.1W_25PPM; Case: 0603; Mounted: Yes; Sense: No; Socket: No; SMD: Yes; Manufacturer1 Example: PANASONIC; Manufacturer1 ComponentHeight: 0.55mm; HelpURL: \\cern.ch\dfs\Applications\Altium\Datasheets\R0603_PANASONIC_ERA.pdf; Author: CERN DEM JLC; CreateDate: 11.01.2017; LatestRevisionDate: 11.01.2017
R4 R5 R9 R64 R105 R120 = R0603_0R_JUMPER: Resistor; Part Description: 1A (0.05R Max DC Resistance) Zero Ohm Jumper; Manufacturer: GENERIC; Manufacturer1 Part Number: NRC06Z0; PressFit: No; Mounted: No; Part Number: R0603_0R_JUMPER; Component Kind: Standard; Component Type: Standard; Pin Count: 2; Value: 0; Status: Preferred; Manufacturer Part Number: R0603_0R_JUMPER; Case: 0603; Sense: No; Socket: No; SMD: Yes; Manufacturer1 Example: NIC COMPONENT; Manufacturer1 ComponentHeight: 0.55mm; HelpURL: \\cern.ch\dfs\Applications\Altium\Datasheets\R0603_NIC_NRC.pdf; Author: CERN DEM JLC; CreateDate: 03/12/2007; LatestRevisionDate: 13/03/2008
R6-R8 R10 R13 R14 = R0603_0R_JUMPER: Resistor; Part Description: 1A (0.05R Max DC Resistance) Zero Ohm Jumper; Manufacturer: GENERIC; Manufacturer1 Part Number: NRC06Z0; PressFit: No; Part Number: R0603_0R_JUMPER; Component Kind: Standard; Component Type: Standard; Pin Count: 2; Value: 0; Status: Preferred; Manufacturer Part Number: R0603_0R_JUMPER; Case: 0603; Mounted: Yes; Sense: No; Socket: No; SMD: Yes; Manufacturer1 Example: NIC COMPONENT; Manufacturer1 ComponentHeight: 0.55mm; HelpURL: \\cern.ch\dfs\Applications\Altium\Datasheets\R0603_NIC_NRC.pdf; Author: CERN DEM JLC; CreateDate: 03/12/2007; LatestRevisionDate: 13/03/2008
R11 = R0402_4R7_1%_0.0625W_200PPM: Resistor - 1%; Part Description: General Purpose Thick Film Chip Resistor; Manufacturer: GENERIC; Manufacturer1 Part Number: 232270674708L; TC: ±200ppm/°C; PressFit: No; Part Number: R0402_4R7_1%_0.0625W_200PPM; Component Kind: Standard; Component Type: Standard; Pin Count: 2; Value: 4R7; Status: Not Recommended; Power: 0.0625W; Manufacturer Part Number: R0402_4R7_1%_0.0625W_200PPM; Case: 0402; Mounted: Yes; Sense: No; Socket: No; SMD: Yes; Manufacturer1 Example: YAGEO PHYCOMP; Manufacturer1 ComponentHeight: 0.4mm; HelpURL: \\cern.ch\dfs\Applications\Altium\Datasheets\R0402_Phycomp_RC0402.pdf; Author: CERN DEM JLC; CreateDate: 03.12.2007; LatestRevisionDate: 17.10.2012
R12 = R0402_100K_1%_0.0625W_100PPM: Resistor - 1%; Part Description: General Purpose Thick Film Chip Resistor; Manufacturer: GENERIC; Manufacturer1 Part Number: 232270671004L; TC: ±100ppm/°C; PressFit: No; Part Number: R0402_100K_1%_0.0625W_100PPM; Component Kind: Standard; Component Type: Standard; Pin Count: 2; Value: 100k; Status: Not Recommended; Power: 0.0625W; Manufacturer Part Number: R0402_100K_1%_0.0625W_100PPM; Case: 0402; Mounted: Yes; Sense: No; Socket: No; SMD: Yes; Manufacturer1 Example: YAGEO PHYCOMP; Manufacturer1 ComponentHeight: 0.4mm; HelpURL: \\cern.ch\dfs\Applications\Altium\Datasheets\R0402_Phycomp_RC0402.pdf; Author: CERN DEM JLC; CreateDate: 03.12.2007; LatestRevisionDate: 17.10.2012
R15 R103 = R0402_10K_1%_0.0625W_100PPM: Resistor - 1%; Part Description: General Purpose Thick Film Chip Resistor; Manufacturer: GENERIC; Manufacturer1 Part Number: 232270671003L; TC: ±100ppm/°C; PressFit: No; Part Number: R0402_10K_1%_0.0625W_100PPM; Component Kind: Standard; Component Type: Standard; Pin Count: 2; Value: 10k; Status: Not Recommended; Power: 0.0625W; Manufacturer Part Number: R0402_10K_1%_0.0625W_100PPM; Case: 0402; Mounted: Yes; Sense: No; Socket: No; SMD: Yes; Manufacturer1 Example: YAGEO PHYCOMP; Manufacturer1 ComponentHeight: 0.4mm; HelpURL: \\cern.ch\dfs\Applications\Altium\Datasheets\R0402_Phycomp_RC0402.pdf; Author: CERN DEM JLC; CreateDate: 03.12.2007; LatestRevisionDate: 17.10.2012
  R103: Tolerance: ±1%
R16 = R0402_51K_1%_0.0625W_100PPM: Resistor - 1%; Part Description: General Purpose Thick Film Chip Resistor; Manufacturer: GENERIC; Manufacturer1 Part Number: 232270675103L; TC: ±100ppm/°C; PressFit: No; Part Number: R0402_51K_1%_0.0625W_100PPM; Component Kind: Standard; Component Type: Standard; Pin Count: 2; Value: 51k; Status: Not Recommended; Power: 0.0625W; Manufacturer Part Number: R0402_51K_1%_0.0625W_100PPM; Case: 0402; Mounted: Yes; Sense: No; Socket: No; SMD: Yes; Manufacturer1 Example: YAGEO PHYCOMP; Manufacturer1 ComponentHeight: 0.4mm; HelpURL: \\cern.ch\dfs\Applications\Altium\Datasheets\R0402_Phycomp_RC0402.pdf; Author: CERN DEM JLC; CreateDate: 03.12.2007; LatestRevisionDate: 17.10.2012
R19 = R0402_5K6_1%_0.0625W_100PPM: Resistor - 1%; Part Number: R0402_5K62_1%_0.0625W_100PPM; Part Description: General Purpose Thick Film Chip Resistor; Manufacturer: GENERIC; TC: ±100ppm/°C; PressFit: No; Component Kind: Standard; Component Type: Standard; Pin Count: 2; Value: 5k62; Status: Not Recommended; Power: 0.0625W; Manufacturer Part Number: R0402_5K62_1%_0.0625W_100PPM; Case: 0402; Mounted: Yes; Sense: No; Socket: No; SMD: Yes; Manufacturer1 ComponentHeight: 0.4mm; HelpURL: \\cern.ch\dfs\Applications\Altium\Datasheets\R0402_Phycomp_RC0402.pdf; Author: CERN DEM JLC; CreateDate: 03.12.2007; LatestRevisionDate: 17.10.2012; Manufacturer1 Example: YAGEO PHYCOMP
R32 = R0603_49K9_0.1%_0.063W_10PPM: Resistor - 0.1%; Part Description: Thin Film Chip Resistor; Manufacturer: GENERIC; Manufacturer1 Part Number: RN73C1J49K9BTDF; Power: 0.063W; TC: ±10ppm; PressFit: No; Part Number: R0603_49K9_0.1%_0.063W_10PPM; Component Kind: Standard; Component Type: Standard; Pin Count: 2; Value: 49k9; Status: Not Recommended; Tolerance: ±0.1%; Manufacturer Part Number: R0603_49K9_0.1%_0.063W_10PPM; Case: 0603; Mounted: Yes; Sense: No; Socket: No; SMD: Yes; Manufacturer1 Example: TYCO HOLSWORTHY; Manufacturer1 ComponentHeight: 0.5mm; HelpURL: \\cern.ch\dfs\Applications\Altium\Datasheets\R0603_Tyco_RN73.pdf; Author: CERN DEM JLC; CreateDate: 03/12/2007; LatestRevisionDate: 13/03/2008
R74 R97 R99 R100 = R0402_0R_JUMPER: Resistor; Part Description: 1A (0.05R Max DC Resistance) Zero Ohm Jumper; Manufacturer: GENERIC; Manufacturer1 Part Number: 232270591001L; PressFit: No; Part Number: R0402_0R_JUMPER; Component Kind: Standard; Component Type: Standard; Pin Count: 2; Value: 0; Status: Not Recommended; Manufacturer Part Number: R0402_0R_JUMPER; Case: 0402; Mounted: Yes; Sense: No; Socket: No; SMD: Yes; Manufacturer1 Example: YAGEO PHYCOMP; Manufacturer1 ComponentHeight: 0.4mm; HelpURL: \\cern.ch\dfs\Applications\Altium\Datasheets\R0402_Phycomp_RC0402.pdf; Author: CERN DEM JLC; CreateDate: 03.12.2007; LatestRevisionDate: 17.10.2012
R84 R104 = R0603_50R_0.1%_0.125W_25PPM_VISHAY_FC0603E50R0BTBST1: Resistor - 0.1%; Part Description: High Frequency (up to 40 GHz) Thin Film Surface Mount Chip Resistor; Manufacturer: VISHAY DALE; Power: 0.125W; TC: ±25ppm/°C; PressFit: No; Part Number: R0603_50R_0.1%_0.125W_25PPM_VISHAY_FC0603E50R0BTBST1; Component Kind: Standard; Component Type: Standard; Pin Count: 2; Value: 50; Status: Not Recommended; Manufacturer Part Number: FC0603E50R0BTBST1; Case: 0603; Mounted: Yes; Sense: No; Socket: No; SMD: Yes; ComponentHeight: 0.38mm; HelpURL: \\cern.ch\dfs\Applications\Altium\Datasheets\R0603_VISHAY_FC.pdf; Author: CERN DEM JLC; CreateDate: 16.11.2017; LatestRevisionDate: 28.06.2022
R101 = R0402_2K4_1%_0.0625W_100PPM: Resistor - 1%; Part Description: General Purpose Thick Film Chip Resistor; Manufacturer: GENERIC; Manufacturer1 Part Number: 232270672402L; TC: ±100ppm/°C; PressFit: No; Part Number: R0402_2K4_1%_0.0625W_100PPM; Component Kind: Standard; Component Type: Standard; Pin Count: 2; Value: 2k4; Status: Not Recommended; Power: 0.0625W; Tolerance: ±1%; Manufacturer Part Number: R0402_2K4_1%_0.0625W_100PPM; Case: 0402; Mounted: Yes; Sense: No; Socket: No; SMD: Yes; Manufacturer1 Example: YAGEO PHYCOMP; Manufacturer1 ComponentHeight: 0.4mm; HelpURL: \\cern.ch\dfs\Applications\Altium\Datasheets\R0402_Phycomp_RC0402.pdf; Author: CERN DEM JLC; CreateDate: 03.12.2007; LatestRevisionDate: 17.10.2012
R102 R107 R108 = R0402_5K1_1%_0.0625W_100PPM: Resistor - 1%; Part Description: General Purpose Thick Film Chip Resistor; Manufacturer: GENERIC; Manufacturer1 Part Number: 232270675102L; TC: ±100ppm/°C; PressFit: No; Part Number: R0402_5K1_1%_0.0625W_100PPM; Component Kind: Standard; Component Type: Standard; Pin Count: 2; Value: 5k1; Status: Not Recommended; Power: 0.0625W; Tolerance: ±1%; Manufacturer Part Number: R0402_5K1_1%_0.0625W_100PPM; Case: 0402; Mounted: Yes; Sense: No; Socket: No; SMD: Yes; Manufacturer1 Example: YAGEO PHYCOMP; Manufacturer1 ComponentHeight: 0.4mm; HelpURL: \\cern.ch\dfs\Applications\Altium\Datasheets\R0402_Phycomp_RC0402.pdf; Author: CERN DEM JLC; CreateDate: 03.12.2007; LatestRevisionDate: 17.10.2012
R106 = R0603_50R_0.1%_0.125W_25PPM_VISHAY_FC0603E50R0BTBST1: Resistor - 0.1%; Part Description: High Frequency (up to 40 GHz) Thin Film Surface Mount Chip Resistor; Manufacturer: VISHAY DALE; Power: 0.125W; TC: ±25ppm/°C; PressFit: No; Mounted: No; Part Number: R0603_50R_0.1%_0.125W_25PPM_VISHAY_FC0603E50R0BTBST1; Component Kind: Standard; Component Type: Standard; Pin Count: 2; Value: 50; Status: Not Recommended; Manufacturer Part Number: FC0603E50R0BTBST1; Case: 0603; Sense: No; Socket: No; SMD: Yes; ComponentHeight: 0.38mm; HelpURL: \\cern.ch\dfs\Applications\Altium\Datasheets\R0603_VISHAY_FC.pdf; Author: CERN DEM JLC; CreateDate: 16.11.2017; LatestRevisionDate: 28.06.2022
R109 = R0402_220R_1%_0.0625W_100PPM: Resistor - 1%; Part Description: General Purpose Thick Film Chip Resistor; Manufacturer: GENERIC; Manufacturer1 Part Number: 232270672201L; TC: ±100ppm/°C; PressFit: No; Part Number: R0402_220R_1%_0.0625W_100PPM; Component Kind: Standard; Component Type: Standard; Pin Count: 2; Value: 220; Status: Not Recommended; Power: 0.0625W; Tolerance: ±1%; Manufacturer Part Number: R0402_220R_1%_0.0625W_100PPM; Case: 0402; Mounted: Yes; Sense: No; Socket: No; SMD: Yes; Manufacturer1 Example: YAGEO PHYCOMP; Manufacturer1 ComponentHeight: 0.4mm; HelpURL: \\cern.ch\dfs\Applications\Altium\Datasheets\R0402_Phycomp_RC0402.pdf; Author: CERN DEM JLC; CreateDate: 03.12.2007; LatestRevisionDate: 17.10.2012
R110 R111 R119 = R0603_1K_0.1%_0.063W_10PPM: Resistor - 0.1%; Part Description: Thin Film Chip Resistor; Manufacturer: GENERIC; Manufacturer1 Part Number: RN73C1J1K0BTG; Power: 0.063W; PressFit: No; Part Number: R0603_1K_0.1%_0.063W_10PPM; Component Kind: Standard; Component Type: Standard; Pin Count: 2; Value: 1k; Status: Not Recommended; Tolerance: ±0.1%; Manufacturer Part Number: R0603_1K_0.1%_0.063W_10PPM; Case: 0603; Mounted: Yes; Sense: No; Socket: No; SMD: Yes; Manufacturer1 Example: TYCO HOLSWORTHY; Manufacturer1 ComponentHeight: 0.55mm; HelpURL: \\cern.ch\dfs\Applications\Altium\Datasheets\R0603_Tyco_RN73.pdf; Author: CERN DEM BC; CreateDate: 23/05/2016; LatestRevisionDate: 23/05/2016
R112 = R0603_39K_1%_0.1W_100PPM: Resistor - 1%; Part Description: General Purpose Thick Film Chip Resistor; Manufacturer: GENERIC; Manufacturer1 Part Number: NRC06F3902TRF; Power: 0.1W; TC: ±100ppm/°C; PressFit: No; Part Number: R0603_39K_1%_0.1W_100PPM; Component Kind: Standard; Component Type: Standard; Pin Count: 2; Value: 39k; Status: Preferred; Tolerance: ±1%; Manufacturer Part Number: R0603_39K_1%_0.1W_100PPM; Case: 0603; Mounted: Yes; Sense: No; Socket: No; SMD: Yes; Manufacturer1 Example: NIC COMPONENT; Manufacturer1 ComponentHeight: 0.55mm; HelpURL: \\cern.ch\dfs\Applications\Altium\Datasheets\R0603_NIC_NRC.pdf; Author: CERN DEM JLC; CreateDate: 03.12.2007; LatestRevisionDate: 13.03.2008
R113 R118 = R0603_33K2_0.1%_0.063W_10PPM: Resistor - 0.1%; Part Description: Thin Film Chip Resistor; Manufacturer: GENERIC; Manufacturer1 Part Number: RN73C1J33K2BTDF; Power: 0.063W; PressFit: No; Part Number: R0603_33K2_0.1%_0.063W_10PPM; Component Kind: Standard; Component Type: Standard; Pin Count: 2; Value: 33k2; Status: Not Recommended; Tolerance: ±0.1%; Manufacturer Part Number: R0603_33K2_0.1%_0.063W_10PPM; Case: 0603; Mounted: Yes; Sense: No; Socket: No; SMD: Yes; Manufacturer1 Example: TYCO HOLSWORTHY; Manufacturer1 ComponentHeight: 0.5mm; HelpURL: \\cern.ch\dfs\Applications\Altium\Datasheets\R0603_Tyco_RN73.pdf; Author: CERN DEM JLC; CreateDate: 03/12/2007; LatestRevisionDate: 13/03/2008
R114-R117 = R0805_866K_0.1%_0.1W_10PPM: Resistor - 0.1%; Part Description: Thin Film Chip Resistor; Manufacturer: GENERIC; Manufacturer1 Part Number: RN73C2A866KB; Power: 0.1W; PressFit: No; Part Number: R0805_866K_0.1%_0.1W_10PPM; Component Kind: Standard; Component Type: Standard; Pin Count: 2; Value: 866k; Status: Not Recommended; Manufacturer Part Number: R0805_866K_0.1%_0.1W_10PPM; Case: 0805; Mounted: Yes; Sense: No; Socket: No; SMD: Yes; Manufacturer1 Example: TYCO HOLSWORTHY; Manufacturer1 ComponentHeight: 0.6mm; HelpURL: \\cern.ch\dfs\Applications\Altium\Datasheets\R0805_Tyco_RN73.pdf; Author: CERN DEM BC; CreateDate: 30.11.2020; LatestRevisionDate: 30.11.2020
TP2-TP4 = SMD_PAD_1.27X1.27MM: Part Description: 1.27mm x 1.27mm PCB Copper Area (SMD Test Point); Mounted: No; Part Number: SMD_PAD_1.27X1.27MM; Component Kind: Standard (No BOM); Component Type: Standard (No BOM); Pin Count: 1; Family: Test Point; Socket: No; SMD: Yes; Sense: No; Status: None; ComponentHeight: 0mm; HelpURL: Undefined; Author: CERN DEM JLC; CreateDate: 12/01/2008; LatestRevisionDate: 12/01/2008; PackageDescription: 1.27mm x 1.27mm PCB Copper Area (SMD Test Point)
TR1 = XFMR_MINI-CIRCUITS_ADT2-1T-1P+: 50 Ohms 8 To 600MHz RF Transformer; Part Number: XFMR_MINI-CIRCUITS_ADT2-1T-1P+; Component Kind: Standard; Component Type: Standard; Pin Count: 6; Value: 1:2; Status: None; Part Description: 50 Ohms 8 To 600MHz RF Transformer; Manufacturer: MINI-CIRCUITS; Mounted: Yes; Socket: No; Sense: No; SMD: Yes; ComponentHeight: 2.84mm; HelpURL: \\cern.ch\dfs\Applications\Altium\Datasheets\XFMR_MINI-CIRCUITS_ADT2-1T-1P+.pdf; Author: CERN DEM MR; CreateDate: 06/09/2017; LatestRevisionDate: 06/09/2017